# EAGLE design sensorfly_radio (EAGLE 5.11)
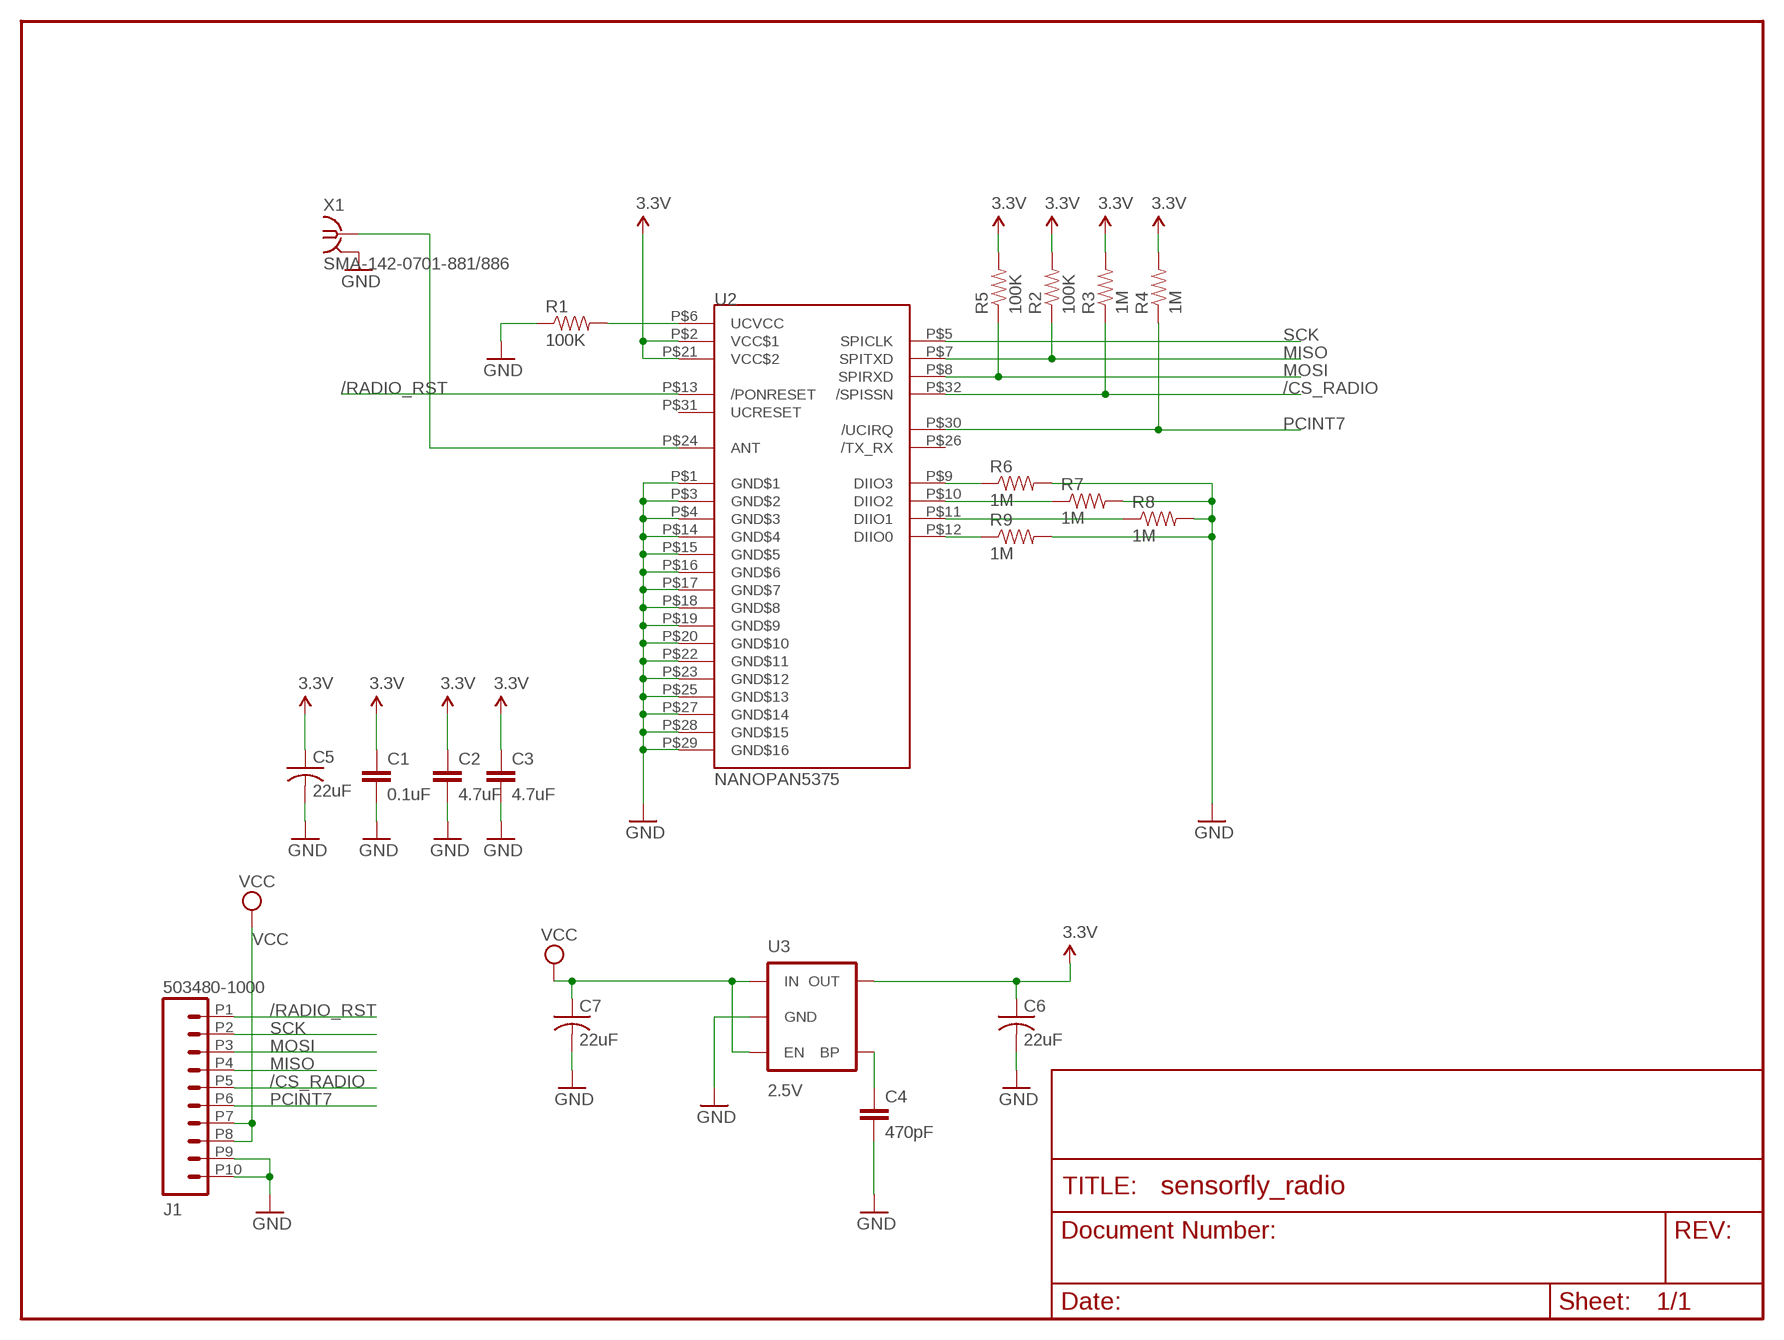
[diagram p0: schematic, sheet 1]

## Parts
C1  0.1uF  CAP0402-CAP  [0402-CAP]
C2  4.7uF  CAP0805  [0805]
C3  4.7uF  CAP0805  [0805]
C4  470pF  CAP0402-CAP  [0402-CAP]
C5  22uF  C-USC0805  [C0805]
C6  22uF  C-USC0805  [C0805]
C7  22uF  C-USC0805  [C0805]
J1  503480-1000  [503480-1000]
R1  100K  RESISTOR0402-RES  [0402-RES]
R2  100K  RESISTOR0402-RES  [0402-RES]
R3  1M  RESISTOR0402-RES  [0402-RES]
R4  1M  RESISTOR0402-RES  [0402-RES]
R5  100K  RESISTOR0402-RES  [0402-RES]
R6  1M  RESISTOR0402-RES  [0402-RES]
R7  1M  RESISTOR0402-RES  [0402-RES]
R8  1M  RESISTOR0402-RES  [0402-RES]
R9  1M  RESISTOR0402-RES  [0402-RES]
U2  NANOPAN5375  [NANOPAN5375]
U3  2.5V  V_REG_LDOSMD  [SOT23-5]
X1  SMA-142-0701-881/886  [J502-ND-142-0701-881/886]

## Nets
3.3V: C1.1 C2.1 C3.1 C5.1 C6.1 R2.2 R3.2 R4.2 R5.2 U2.P$2(VCC$1) U2.P$21(VCC$2) U3.5(OUT)
/CS_RADIO: J1.P5 R3.1 U2.P$32(/SPISSN)
/RADIO_RST: J1.P1 U2.P$13(/PONRESET)
GND: C1.2 C2.2 C3.2 C4.2 C5.2 C6.2 C7.2 J1.P9 J1.P10 R1.1 R6.2 R7.2 R8.2 R9.2 U2.P$1(GND$1) U2.P$3(GND$2) U2.P$4(GND$3) U2.P$14(GND$4) U2.P$15(GND$5) U2.P$16(GND$6) U2.P$17(GND$7) U2.P$18(GND$8) U2.P$19(GND$9) U2.P$20(GND$10) U2.P$22(GND$11) U2.P$23(GND$12) U2.P$25(GND$13) U2.P$27(GND$14) U2.P$28(GND$15) U2.P$29(GND$16) U3.2(GND) X1.G@1(GND)
MISO: J1.P4 R2.1 U2.P$7(SPITXD)
MOSI: J1.P3 R5.1 U2.P$8(SPIRXD)
N$2: C4.1 U3.4(BP)
N$40: U2.P$24(ANT) X1.1
N$100: R1.2 U2.P$6(UCVCC)
N$102: R6.1 U2.P$9(DIIO3)
N$103: R7.1 U2.P$10(DIIO2)
N$104: R8.1 U2.P$11(DIIO1)
N$105: R9.1 U2.P$12(DIIO0)
PCINT7: J1.P6 R4.1 U2.P$30(/UCIRQ)
SCK: J1.P2 U2.P$5(SPICLK)
VCC: C7.1 J1.P7 J1.P8 U3.1(IN) U3.3(EN)
Unconnected: U2.P$26(/TX_RX) U2.P$31(UCRESET)

## Power pins joined to a net without a drawn wire
GND: X1.G@2(GND) X1.G@3(GND) X1.G@4(GND)

## Library data of the parts
C1-C4 = SparkFun:CAP: Capacitor Standard 0603 ceramic capacitor, and 0.1" leaded capacitor.
C5-C7 = rcl:C-US: CAPACITOR, American symbol
J1 = pei:503480-1000
R1-R9 = SparkFun:RESISTOR: Resistor Basic schematic elements and footprints for 0603, 1206, and PTH resistors.
U2 = pei:NANOPAN5375
U3 = SparkFun:V_REG_LDO: Voltage Regulator LDO Standard 150mA LDO voltage regulator in SOT-23 layout. Micrel part MIC5205. BP (by-pass) pin is used to lower output noise with 470pF cap.
X1 = con-coax:SMA-: SMA 50 Ohm End Launch Jack Receptacle - Round Contact Johnson Components Source: www.johnsoncomponents.com .. J502-ND.pdf; MF: JOHNSON COMPONENTS; MPN: 142-0701-881; OC_FARNELL: 1608603; OC_NEWARK: 08B906

## Net classes
0 default: width 0.152 mm, drill 0.152 mm, clearance 0.152 mm
1 power: width 0.254 mm, drill 0.305 mm, clearance 0.152 mm

## Board
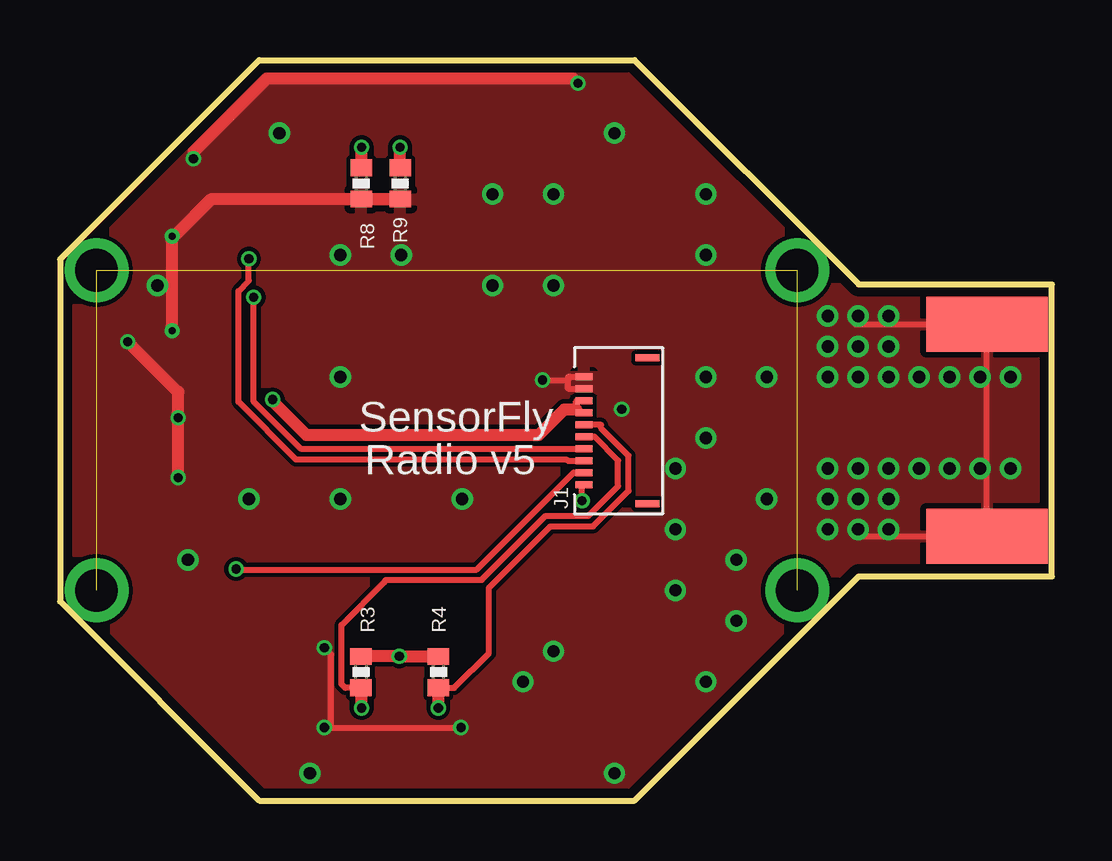
[diagram p1: board, top side]
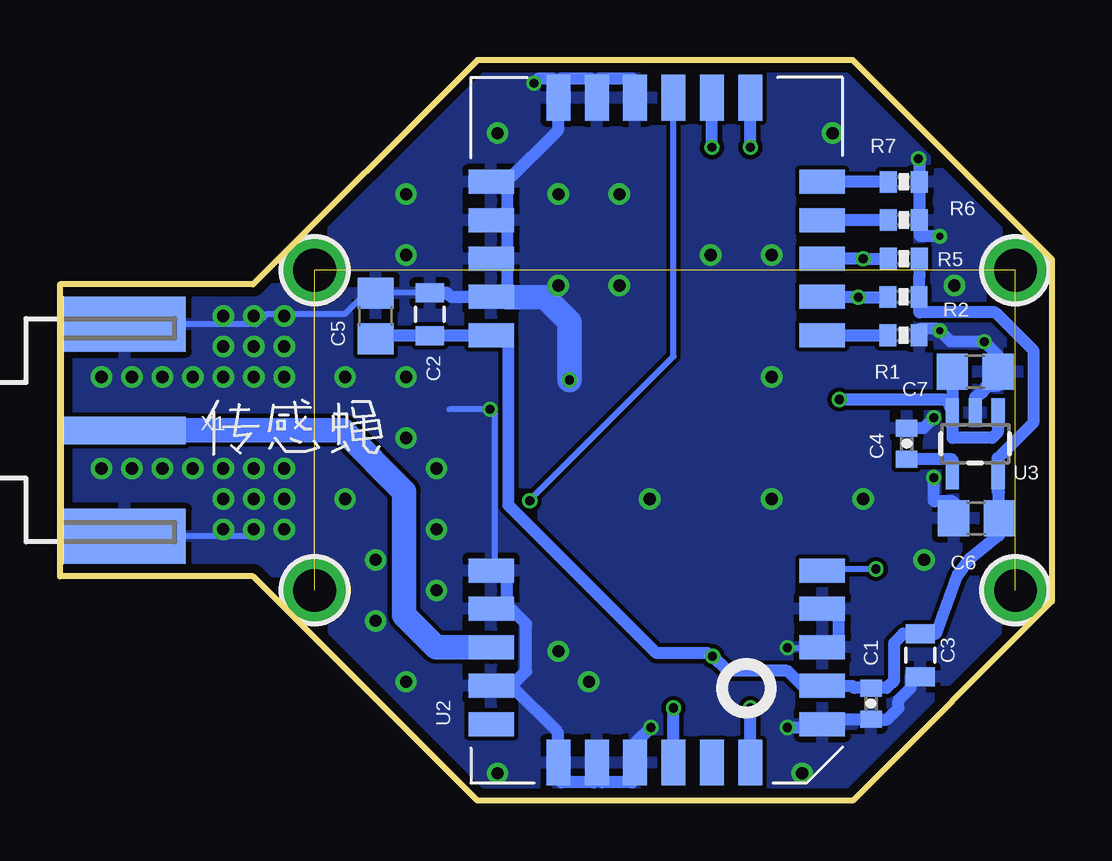
[diagram p2: board, bottom side, seen from below]

Size 41.35 x 30.86 mm. Coordinates in mm from the lower left corner, seen from the top.
Outline: 0,22.55 8.31,30.86 23.95,30.86 33.3,21.51 41.35,21.51 41.35,9.35 33.3,9.35 23.95,0 8.31,0 0,8.31 0,22.55
Copper layers (1*2+15*16): Top 0.0356mm / dielectric 1.5011mm / Route2 0.0356mm / dielectric 0.1499mm / Route15 0.0356mm / dielectric 0.2007mm / Bottom 0.0356mm
Design rules "typical_4pcb *": minimum track width 5mil, minimum drill 6mil, track to track 7mil, track to pad 7mil, pad to pad 7mil, via to via 7mil, smd to smd 6mil, copper to edge 15mil, drill to drill 8mil, minimum pad ring 10mil, minimum via ring 5mil, stop-mask expansion 4mil, vias tented up to drill 10mil, thermal gap 10mil

### Footprints (pad centres in the part's own frame; a part is rotated, then mirrored left to right if it is on the bottom)
0402-CAP = smd 0.7 x 0.9: 1 -0.65,0; 2 0.65,0
0805 = smd 0.8 x 1.2: 1 -0.9,0; 2 0.9,0
C0805 = smd 1.3 x 1.5: 1 -0.95,0; 2 0.95,0
503480-1000 = smd 0.3 x 0.7: P1 -2,0; P2 -1.5,0; P3 -1,0; P4 -0.5,0; P5 0,0; P6 0.5,0; P7 1,0; P8 1.5,0; P9 2,0; P10 2.5,0 | smd 0.3 x 1: P$11 -2.79,-2.65; P$12 3.29,-2.65
0402-RES = smd 0.7 x 0.9: 1 -0.65,0; 2 0.65,0
NANOPAN5375 = smd 1 x 1.9: P$1 0,0; P$2 1.6,0; P$3 3.2,0; P$4 4.8,0; P$5 6.4,0; P$6 16.2,0; P$7 17.8,0; P$8 19.4,0; P$9 21,0; P$10 22.6,0; P$17 22.6,13.8; P$18 21,13.8; P$19 19.4,13.8; P$20 17.8,13.8; P$21 16.2,13.8; P$22 6.4,13.8; P$23 4.8,13.8; P$24 3.2,13.8; P$25 1.6,13.8; P$26 0,13.8 | smd 1.9 x 1: P$11 26.1,3; P$12 26.1,4.6; P$13 26.1,6.2; P$14 26.1,7.8; P$15 26.1,9.4; P$16 26.1,11; P$27 -1.6,11; P$28 -1.6,9.4; P$29 -1.6,7.8; P$30 -1.6,6.2; P$31 -1.6,4.6; P$32 -1.6,3
SOT23-5 = smd 0.55 x 1.2: 1 -0.95,-1.3; 2 0,-1.3; 3 0.95,-1.3; 4 0.95,1.3; 5 -0.95,1.3
J502-ND-142-0701-881/886 = smd 5.08 x 1.143: 1 2.565,0 | smd 5.08 x 2.286: G@1 2.565,4.42; G@2 2.565,-4.42 | smd 5.08 x 2.286 bottom: G@3 2.565,4.42; G@4 2.565,-4.42

### Placement (x,y rotation side)
C1  7.54,4.04 270 bottom
C2  25.93,20.27 90 bottom
C3  5.49,6.06 270 bottom
C4  6.06,14.87 90 bottom
C5  28.19,20.19 90 bottom
C6  3.15,11.76 180 bottom
C7  3.2,17.87 0 bottom
J1  21.84,15.16 90 top
R1  6.18,19.39 180 bottom
R2  6.18,20.99 0 bottom
R3  12.55,5.36 90 top
R4  15.77,5.36 90 top
R5  6.17,22.58 0 bottom
R6  6.17,24.19 0 bottom
R7  6.17,25.78 0 bottom
R8  12.56,25.72 270 top
R9  14.19,25.72 270 top
U2  9.58,3.19 90 bottom
U3  3.2,14.87 180 bottom
U$1  [SENSORFLY_SMALLER]  31.5,15.62 0 bottom
X1  41.21,15.43 0 bottom

### Tracks (layer width: path | path; a pad name or v marks a point on that pad's centre or on a via)
3.3V  (via drill 0.38 pad 0.64)
  Top 0.508: R3.2 12.78,6.02 v14.15,6.02 R4.2
  Bottom 0.508: R5.2 5.51,22.58 5.51,21.87 5.54,21.84 5.54,21.01 R2.2 5.54,20.75 5.54,20.37 5.51,20.34 2.36,20.34 0.76,18.74 0.76,15.77 2.26,14.27 2.26,13.82 U3.5 2.26,12.88 2.23,12.85 2.21,12.85 C6.1 2.21,11.53 2.21,11.05 3.43,10.08 3.94,9.37 4.83,6.96 5.26,6.96 C3.1 6.2,6.96 6.58,6.58 6.58,5 6.88,4.7 7.31,4.7 C1.1 8.25,4.7 8.33,4.77 U2.P$2 9.8,4.77 10.29,4.77 10.31,4.8 10.41,4.8 11.02,5.41 13.54,5.41 v14.15,6.02 14.38,6.15 16.48,6.15 22.66,12.32 22.66,19.35 22.68,19.38 23.11,19.38 U2.P$21 23.39,19.38 C2.1 28.07,19.37 C5.1
/CS_RADIO  (via drill 0.38 pad 0.64)
  Top 0.254: J1.P5 22.28,15.16 23.27,14.17 23.27,13.11 22.02,11.86 20.24,11.86 17.58,9.2 13.59,9.2 13.51,9.09 11.73,7.32 11.73,4.85 11.89,4.7 12.32,4.7 R3.1
  Top 0.508: v12.57,3.86 12.57,4.7 12.55,4.72 R3.1
  Bottom 0.508: v12.57,3.86 12.57,1.6 U2.P$32
/RADIO_RST  (via drill 0.38 pad 0.64)
  Top 0.254: v21.77,12.5 21.77,13.16 J1.P1
  Bottom 0.254: 21.77,12.39 v21.77,12.5 21.69,12.6 15.77,18.52 U2.P$13
GND  (via drill 0.3 pad 0.64, 0.38 pad 0.64, 0.51 pad 0.89)
  Top 0.254: v11.02,3.05 11.3,3.05 | 21.29,17.65 21.18,17.65 21.16,17.63 21.16,17.2 21.18,17.17 J1.P9 21.95,17.17 | 21.29,17.65 J1.P10 | v20.12,17.53 21.16,17.53 21.29,17.65 | 38.63,19.84 33.17,19.84 | 33.45,11.02 38.63,11.02 | 38.63,11.02 X1.G@4 | 38.63,11.02 38.63,19.84 | 38.63,19.84 X1.G@3 | v11.02,6.38 11.3,6.1 11.3,3.05 | 11.3,3.05 v16.71,3.05
  Top 0.508: v4.67,19.58 v4.67,23.52 4.9,23.65 6.32,25.07 12.32,25.07 R8.2 14.17,25.07 R9.2 | v5.56,26.75 5.56,27.03 8.64,30.1 21.39,30.1 v21.59,29.9 | v2.82,19.13 4.93,17.02 v4.93,15.95 v4.93,13.46
  Bottom 0.254: C2.2 28.59,21.17 29.49,20.27 32.74,20.27 33.17,19.84 33.19,19.85 X1.G@3 | X1.G@4 33.46,11.01 33.45,11.02 | v11.02,6.38 9.8,6.38 U2.P$3 | U2.P$22 23.22,9.8 23.22,16.1 v23.42,16.31 25.12,16.31
  Bottom 0.508: C3.2 5.89,5.16 5.89,4.7 6.4,4.19 6.4,3.86 6.88,3.38 7.31,3.38 C1.2 7.54,3.38 8.69,3.38 8.86,3.2 9.58,3.2 U2.P$1 9.8,3.2 10.29,3.2 10.44,3.05 v11.02,3.05 | v4.67,23.52 5.49,23.52 5.51,23.55 5.51,24.18 R6.2 5.51,24.44 5.51,25.78 R7.2 5.51,26.01 5.51,26.7 v5.56,26.75 | R1.1 5.54,19.41 5.54,19.66 4.75,19.66 v4.67,19.58 4.22,19.13 v2.82,19.13 2.26,18.57 C7.2 2.26,17.86 2.26,17.3 2.29,17.27 2.74,17.27 2.77,17.25 2.77,17.14 2.97,16.94 3.05,16.94 3.2,16.79 U3.2 | C2.2 25.93,21.16 25.22,21.16 25.04,20.98 23.39,20.98 U2.P$20 23.11,20.98 22.73,20.98 22.71,21.01 22.71,22.35 U2.P$19 22.73,22.58 22.71,22.61 22.71,23.95 U2.P$18 22.73,24.18 22.71,24.21 22.71,25.55 U2.P$17 22.73,25.78 20.6,27.91 20.6,28.58 20.57,28.6 20.57,29.03 U2.P$16 | U2.P$3 8.91,6.38 8.89,6.4 8.89,7.95 8.91,7.98 U2.P$4 | v16.71,3.05 17.37,2.39 17.37,1.83 U2.P$29 17.37,0.89 17.5,0.76 18.75,0.76 U2.P$28 18.97,0.89 19.1,0.76 20.45,0.76 20.57,0.89 U2.P$27 20.57,1.83 20.57,2.29 20.6,2.31 20.6,2.84 22.53,4.77 | 22.53,4.77 U2.P$25 | 22.53,4.77 21.92,5.38 21.92,7.37 22.53,7.98 U2.P$23 22.71,8.2 22.71,9.55 22.73,9.58 U2.P$22 | U2.P$14 17.37,29.31 17.37,30 17.47,30.1 18.87,30.1 18.97,30 18.97,29.31 U2.P$15 19.2,30.1 20.47,30.1 20.57,30 20.57,29.31 U2.P$16 | v21.59,29.9 21.39,30.1 20.8,30.1 U2.P$16 | v4.93,15.95 5.36,15.52 C4.2 | v4.93,13.46 4.93,12.5 4.9,12.47 4.14,12.47 4.09,12.42 4.09,11.76 C6.2
  Bottom 1.016: 22.73,20.98 21.13,20.98 20.12,19.96 v20.12,17.53
  other vias: 34.54,13.84 34.54,12.57 34.54,11.3 33.27,11.3 33.27,12.57 33.27,13.84 32,13.84 32,12.57 32,11.3 32,17.65 32,18.92 32,20.19 33.27,20.19 34.54,20.19 34.54,18.92 33.27,18.92 33.27,17.65 34.54,17.65 35.81,17.65 37.08,17.65 38.35,17.65 39.62,17.65 35.81,13.84 37.08,13.84 38.35,13.84 39.62,13.84 29.46,12.57 29.46,17.65 26.92,17.65 26.92,22.73 26.92,25.27 28.19,7.49 26.92,4.95 20.57,6.22 19.3,4.95 16.76,12.57 11.68,12.57 11.68,17.65 11.68,22.73 14.22,22.73 18.03,25.27 20.57,25.27 20.57,21.46 18.03,21.46 7.87,12.57 5.33,10.03 4.06,21.46 10.41,1.14 23.11,1.14 9.14,27.81 23.11,27.81 25.65,8.76 25.65,11.3 25.65,13.84 26.92,15.11 28.19,10.03
  pour Bottom: 0.1,22.53 8.18,30.61 23.77,30.61 32.92,21.46 41.15,21.46 41.15,9.6 41.07,9.52 32.97,9.52 23.77,0.33 8.53,0.33 0.38,8.48 0.38,20.95 0.15,21.18
  pour Top: 0.18,22.53 8.25,30.61 23.85,30.61 32.99,21.46 41.22,21.46 41.22,9.6 41.15,9.52 33.05,9.52 23.85,0.33 8.61,0.33 0.46,8.48 0.46,20.95 0.23,21.18
MISO  (via drill 0.38 pad 0.64)
  Top 0.254: J1.P4 10.03,14.66 8.08,16.61 v8.08,20.98
  Bottom 0.508: U2.P$7 v8.08,20.98 6.86,20.98 R2.1
MOSI  (via drill 0.38 pad 0.64)
  Top 0.254: J1.P3 21.16,14.17 21.11,14.22 9.83,14.22 7.44,16.61 7.44,21.23 7.87,21.67 v7.87,22.58
  Bottom 0.508: U2.P$8 v7.87,22.58 6.86,22.58 6.83,22.61 6.81,22.58 R5.1
N$1  (via drill 1.78 pad 0.89)  (3 unrouted)
  other vias: 1.52,22.1 1.52,8.76 30.73,8.76 30.73,22.1
N$2
  Bottom 0.508: C4.1 4.17,14.22 4.14,14.2 4.14,13.59 U3.4
N$40
  Bottom 1.016: X1.1 29.55,15.43 27,12.88 27,7.72 25.68,6.4 23.39,6.4 U2.P$24
N$100
  Bottom 0.508: U2.P$6 6.86,19.38 R1.2
N$102
  Bottom 0.508: U2.P$9 6.86,24.18 6.83,24.16 6.81,24.18 R6.1
N$103
  Bottom 0.508: U2.P$10 6.86,25.78 6.83,25.81 6.81,25.78 R7.1
N$104  (via drill 0.38 pad 0.64)
  Top 0.508: v12.57,27.23 12.57,26.39 R8.1
  Bottom 0.508: v12.57,27.23 U2.P$11
N$105  (via drill 0.38 pad 0.64)
  Top 0.508: v14.17,27.23 14.17,26.39 R9.1
  Bottom 0.508: v14.17,27.23 U2.P$12
PCINT7  (via drill 0.38 pad 0.64)
  Top 0.254: J1.P6 21.95,15.67 22.53,15.67 22.55,15.65 22.55,15.52 23.7,14.38 23.7,12.9 22.22,11.43 20.45,11.43 17.88,8.86 17.88,6.15 16.43,4.7 16,4.7 R4.1
  Top 0.508: v15.77,3.86 15.77,4.67 15.75,4.7 15.77,4.72 R4.1
  Bottom 0.508: v15.77,3.86 15.77,1.6 U2.P$30
SCK  (via drill 0.38 pad 0.64)
  Top 0.254: J1.P2 21.41,13.66 17.37,9.63 7.37,9.63 v7.34,9.65
  Bottom 0.254: v7.34,9.65 9.51,9.65 U2.P$5
VCC  (via drill 0.38 pad 0.64)
  Top 0.254: J1.P8 21.54,16.66 21.51,16.64 21.51,16.31 21.51,16.18 21.54,16.15 J1.P7
  Top 0.508: v8.86,16.71 8.86,16.64 10.26,15.24 19.96,15.24 21.03,16.31 21.51,16.31
  Bottom 0.508: U3.3 4.14,16.18 4.14,17.86 C7.1 | U3.3 4.14,15.93 4.14,15.11 2.49,15.11 2.26,15.34 2.26,16.15 U3.1 | v8.86,16.71 4.37,16.71 U3.3

### Text on the board
tPlace: SensorFly | Radio v5